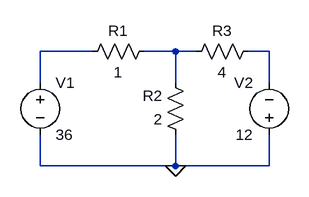
[diagram p0: schematic Draft13.asc]
Draft13.asc, the LTspice schematic file:
Version 4
SHEET 1 880 680
WIRE 160 80 80 80
WIRE 288 80 240 80
WIRE 320 80 288 80
WIRE 432 80 400 80
WIRE 80 128 80 80
WIRE 288 128 288 80
WIRE 432 128 432 80
WIRE 80 256 80 208
WIRE 288 256 288 208
WIRE 288 256 80 256
WIRE 432 256 432 208
WIRE 432 256 288 256
FLAG 288 256 0
SYMBOL voltage 80 112 R0
SYMATTR InstName V1
SYMATTR Value 36
SYMBOL res 256 64 R90
WINDOW 0 0 56 VBottom 2
WINDOW 3 32 56 VTop 2
SYMATTR InstName R1
SYMATTR Value 1
SYMBOL res 304 224 R180
WINDOW 0 36 76 Left 2
WINDOW 3 36 40 Left 2
SYMATTR InstName R2
SYMATTR Value 2
SYMBOL voltage 432 224 R180
WINDOW 0 24 96 Left 2
WINDOW 3 24 16 Left 2
SYMATTR InstName V2
SYMATTR Value 12
SYMBOL res 416 64 R90
WINDOW 0 0 56 VBottom 2
WINDOW 3 32 56 VTop 2
SYMATTR InstName R3
SYMATTR Value 4

The netlist it stands for:
* Draft13.asc
V1 N001 0 36
R1 N002 N001 1
R2 0 N002 2
V2 0 N003 12
R3 N003 N002 4
.backanno
.end